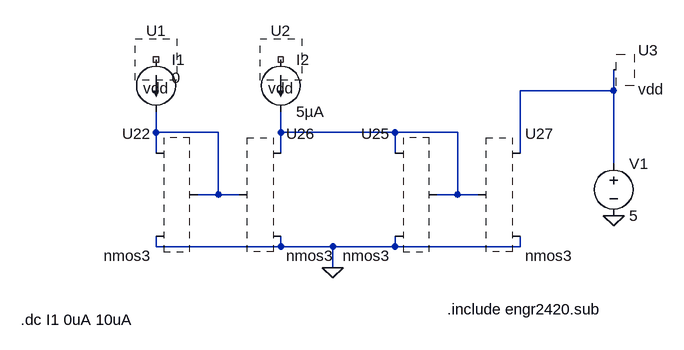
[diagram p0: schematic subtractor.asc]
subtractor.asc, the LTspice schematic file:
Version 4
SHEET 1 1440 932
WIRE 832 -48 832 -80
WIRE 832 -48 688 -48
WIRE 128 16 128 -16
WIRE 224 16 128 16
WIRE 320 16 320 -16
WIRE 496 16 320 16
WIRE 592 16 496 16
WIRE 128 48 128 16
WIRE 320 48 320 16
WIRE 496 48 496 16
WIRE 688 48 688 -48
WIRE 832 64 832 -48
WIRE 224 112 224 16
WIRE 224 112 192 112
WIRE 256 112 224 112
WIRE 592 112 592 16
WIRE 592 112 560 112
WIRE 624 112 592 112
WIRE 128 192 128 176
WIRE 320 192 320 176
WIRE 320 192 128 192
WIRE 400 192 320 192
WIRE 496 192 496 176
WIRE 496 192 400 192
WIRE 688 192 688 176
WIRE 688 192 496 192
WIRE 400 224 400 192
FLAG 400 224 0
FLAG 832 144 0
SYMBOL nmos3 128 112 M0
SYMATTR InstName U22
SYMBOL nmos3 496 112 M0
SYMATTR InstName U25
SYMBOL nmos3 320 112 R0
SYMATTR InstName U26
SYMBOL nmos3 688 112 R0
SYMATTR InstName U27
SYMBOL current 128 -96 R0
WINDOW 3 24 28 Left 2
WINDOW 123 0 0 Left 2
WINDOW 39 0 0 Left 2
SYMATTR Value 0
SYMATTR InstName I1
SYMBOL current 320 -96 R0
WINDOW 123 0 0 Left 2
WINDOW 39 0 0 Left 2
SYMATTR InstName I2
SYMATTR Value 5µA
SYMBOL voltage 832 48 R0
WINDOW 123 0 0 Left 2
WINDOW 39 0 0 Left 2
SYMATTR InstName V1
SYMATTR Value 5
SYMBOL vdd 128 -96 R0
SYMATTR InstName U1
SYMBOL vdd 320 -96 R0
SYMATTR InstName U2
SYMBOL vdd 832 -80 R0
SYMATTR InstName U3
TEXT 576 288 Left 2 !.include engr2420.sub
TEXT -80 304 Left 2 !.dc I1 0uA 10uA

The netlist it stands for:
* subtractor.asc
* U22: nmos3 (symbol nmos3 not available, pin order unknown); nets seen at it: 0, N002
* U25: nmos3 (symbol nmos3 not available, pin order unknown); nets seen at it: 0, N003
* U26: nmos3 (symbol nmos3 not available, pin order unknown); nets seen at it: 0, N002, N003
* U27: nmos3 (symbol nmos3 not available, pin order unknown); nets seen at it: 0, N001, N003
I1 NC_01 N002 0
I2 NC_02 N003 5µA
V1 N001 0 5
* U1: vdd (symbol vdd not available, pin order unknown); nets seen at it: 
* U2: vdd (symbol vdd not available, pin order unknown); nets seen at it: 
* U3: vdd (symbol vdd not available, pin order unknown); nets seen at it: N001
.include engr2420.sub
.dc I1 0uA 10uA
.backanno
.end